# Altium schematic sheet motor.SchDoc
size A
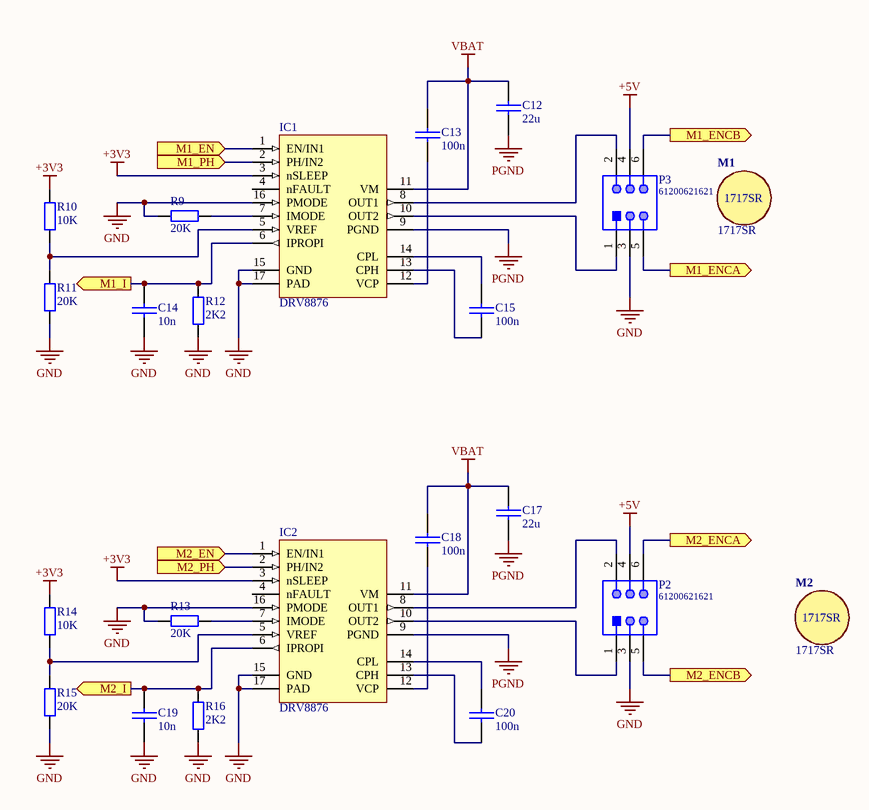
[diagram p0: motor.SchDoc]

## Parts
C12  22u  [C0603_PASTE]
C13  100n  [C0402-Paste]
C14  10n  [C0402-Paste]
C15  100n  [C0402-Paste]
C17  22u  [C0603_PASTE]
C18  100n  [C0402-Paste]
C19  10n  [C0402-Paste]
C20  100n  [C0402-Paste]
IC1  DRV8876  [TSSOP-16H]
IC2  DRV8876  [TSSOP-16H]
M1  1717SR  [Motor]
M2  1717SR  [Motor]
P2  61200621621  [61200621621]
P3  61200621621  [61200621621]
R9  20K  [R0402-Paste]
R10  10K  [R0402-Paste]
R11  20K  [R0402-Paste]
R12  2K2  [R0402-Paste]
R13  20K  [R0402-Paste]
R14  10K  [R0402-Paste]
R15  20K  [R0402-Paste]
R16  2K2  [R0402-Paste]

## Ports
M1_EN (in), M1_ENCA (out), M1_ENCB (out), M1_I (out), M1_PH (in), M2_EN (in), M2_ENCA (out), M2_ENCB (out), M2_I (out), M2_PH (in)

## Nets
+3V3: IC1.3(nSLEEP) IC2.3(nSLEEP) R10.2 R14.2
+5V: P2.4 P3.4
GND: C14.2 C19.2 IC1.15(GND) IC1.16(PMODE) IC1.17(PAD) IC2.15(GND) IC2.16(PMODE) IC2.17(PAD) P2.3 P3.3 R9.1 R11.1 R12.1 R13.1 R15.1 R16.1
PGND: C12.2 C17.2 IC1.9(PGND) IC2.9(PGND)
VBAT: C12.1 C13.1 C17.1 C18.1 IC1.11(VM) IC2.11(VM)
M1_EN: IC1.1(EN/IN1) ; port M1_EN
M1_ENCA: P3.5 ; port M1_ENCA
M1_ENCB: P3.6 ; port M1_ENCB
M1_I: C14.1 IC1.6(IPROPI) R12.2 ; port M1_I
M1_PH: IC1.2(PH/IN2) ; port M1_PH
M2_EN: IC2.1(EN/IN1) ; port M2_EN
M2_ENCA: P2.6 ; port M2_ENCA
M2_ENCB: P2.5 ; port M2_ENCB
M2_I: C19.1 IC2.6(IPROPI) R16.2 ; port M2_I
M2_PH: IC2.2(PH/IN2) ; port M2_PH
NetC13_2: C13.2 IC1.12(VCP)
NetC15_1: C15.1 IC1.14(CPL)
NetC15_2: C15.2 IC1.13(CPH)
NetC18_2: C18.2 IC2.12(VCP)
NetC20_1: C20.1 IC2.14(CPL)
NetC20_2: C20.2 IC2.13(CPH)
NetIC1_5: IC1.5(VREF) R10.1 R11.2
NetIC1_7: IC1.7(IMODE) R9.2
NetIC1_8: IC1.8(OUT1) P3.2
NetIC1_10: IC1.10(OUT2) P3.1
NetIC2_5: IC2.5(VREF) R14.1 R15.2
NetIC2_7: IC2.7(IMODE) R13.2
NetIC2_8: IC2.8(OUT1) P2.2
NetIC2_10: IC2.10(OUT2) P2.1

Not connected (* = marked no-connect by the designer): IC1 4(nFAULT); IC2 4(nFAULT)

## Library data of the parts
C12 C17 = C-0603: Multilayer Ceramic Capacitors MLCC - SMD 0603; Value: 22u; Manufacturer: -; Manufacturer PN: -; Supplier: digikey.ca
C13-C15 C18-C20 = C-0402: Multilayer Ceramic Capacitors MLCC - SMD  0402; Manufacturer: -; Manufacturer PN: -; Supplier: digikey.ca
  C13 C15 C18 C20: Value: 100n
  C14 C19: Value: 10n
IC1 IC2 = DRV8876: PWR MGMT MOTOR/FAN DRIVER; pin to pad: 17>HS; Supplier 1: Mouser; ComponentLink1Description: Digy-key; ComponentLink1URL: https://www.digikey.sk/product-detail/en/texas-instruments/DRV8876PWPR/296-53515-1-ND/10270213; ComponentLink2Description: Datasheet; ComponentLink2URL: www.ti.com/lit/ds/symlink/drv8876.pdf; Supplier Part Number 1: 595-DRV8876PWPR; Value: DRV8876
P2 P3 = CMP-1502-00000-1: Male Box Header WR-BHD, THT, Vertical, pitch 2.54 mm, 6 pins; Manufacturer: Wurth Elektronik; Withstanding Voltage: 500VAC; Working Voltage: 250VAC; Pin Number: 6; Pitch: 2.54mm; Contact Resistance: 20mOhm; Part Number: 61200621621; Manufacturer URL: http://www.we-online.de; Published Date: August2018; Orientation: Vertical; Publisher: WurthElektronik; Operating Temperature: -40to125degC; Datasheet URL: https://katalog.we-online.de/em/datasheet/6120xx21621.pdf; Mounting Technology: THT; Packaging: Tray; Gender: Male; Package Reference: 61200621621
R9-R16 = R-0402: RES SMD 0402; Manufacturer: -; Manufacturer PN: -; Supplier: digikey.ca
  R9 R11 R13 R15: Value: 20K
  R10 R14: Value: 10K
  R12 R16: Value: 2K2